# Altium project USBc to Ethernet(2.0).PrjPcb (part 1 of 3)
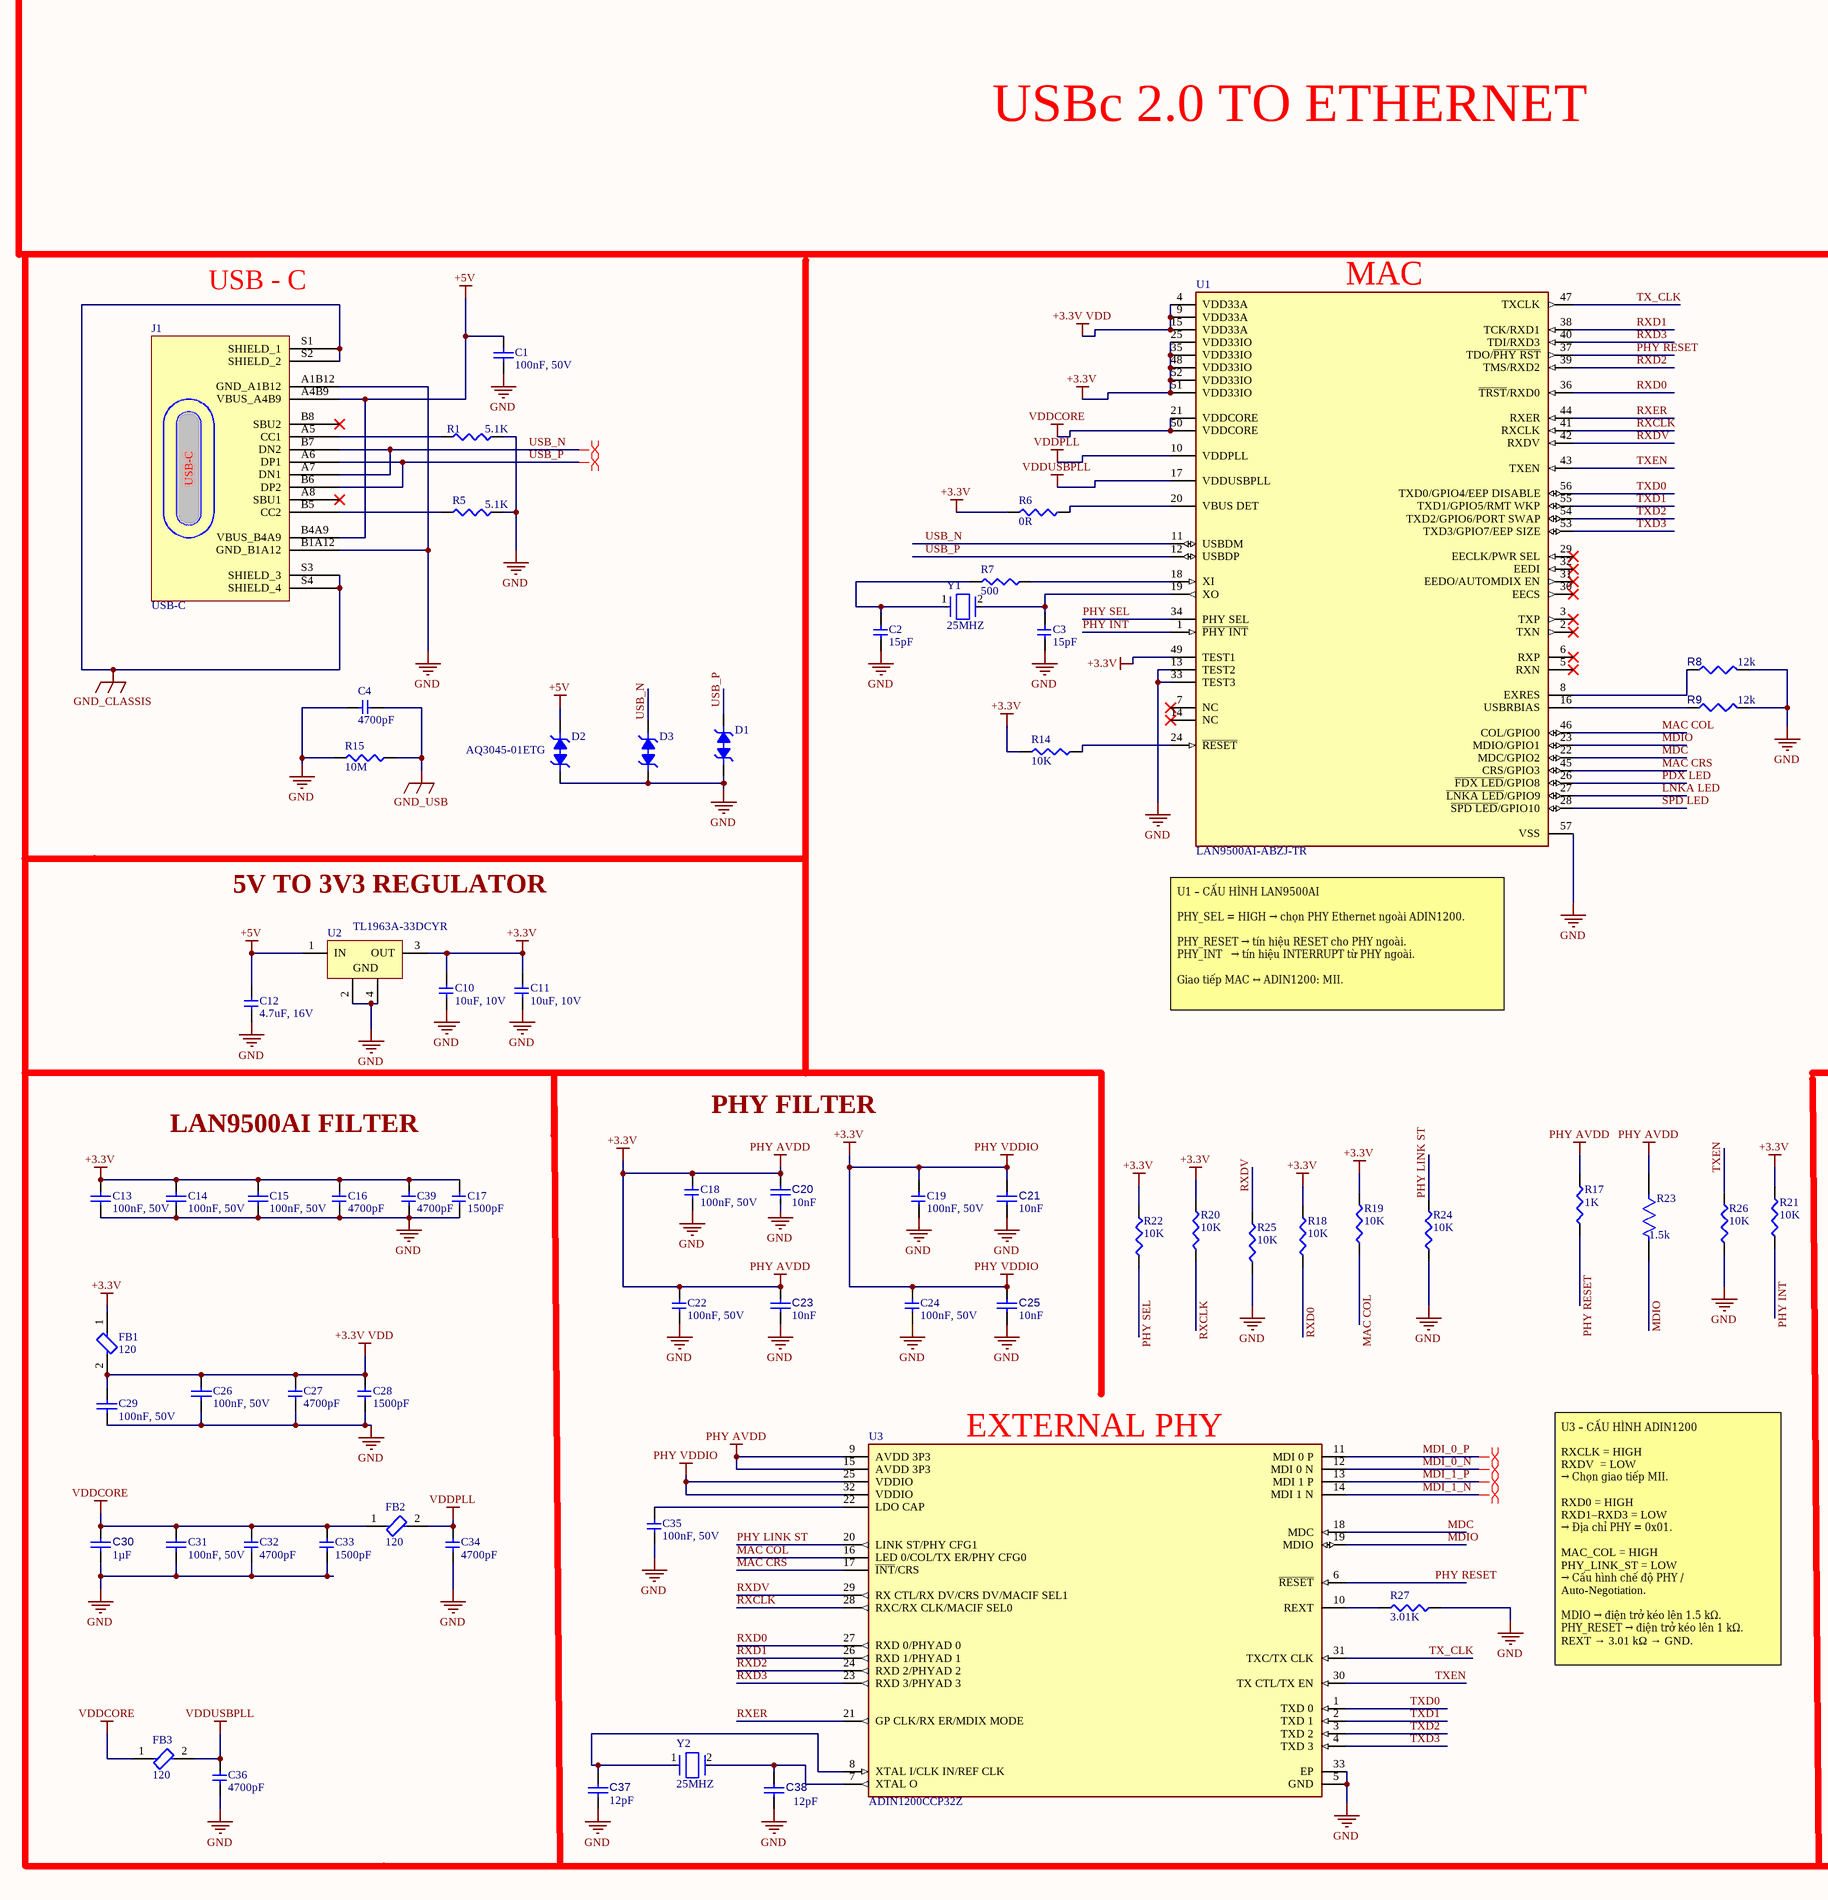
[diagram p0: USBc to Ethernet(2.0).SchDoc, left]
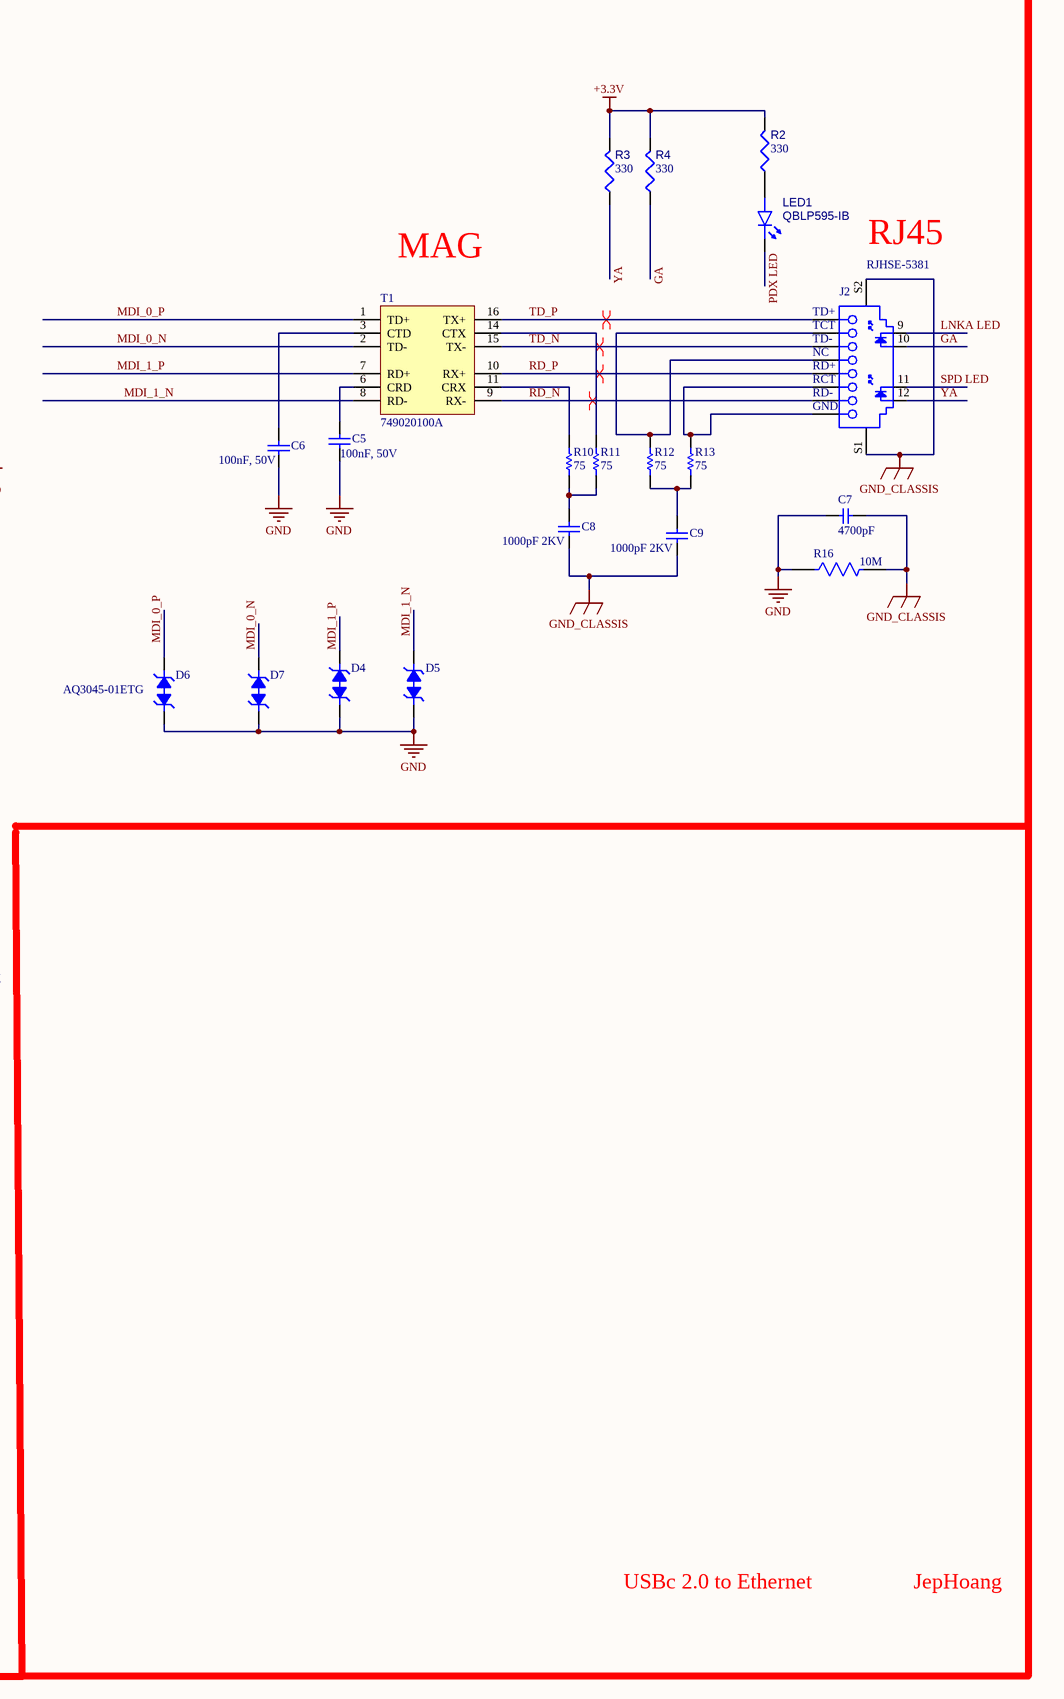
[diagram p1: USBc to Ethernet(2.0).SchDoc, right]
1 sheet, 85 parts. Net scope: global (net labels, ports and power ports of the same name join across sheets).
Board file: USBc to Ethernet(2.0).PcbDoc

## Sheet USBc to Ethernet(2.0).SchDoc
size A2; SheetNumber: 1; SheetTotal: 1

### Parts
C1  100nF, 50V  [CAP_0402]
C2  15pF  [CAP_0402]
C3  15pF  [CAP_0402]
C4  4700pF  [CAP_0402]
C5  100nF, 50V  [CAP_0402]
C6  100nF, 50V  [CAP_0402]
C7  4700pF  [CAP_0402]
C8  1000pF 2KV  [JD-202R18W102KV4E-2_M]
C9  1000pF 2KV  [JD-202R18W102KV4E-2_M]
C10  10uF, 10V  [CAP_0402]
C11  10uF, 10V  [CAP_0402]
C12  4.7uF, 16V  [CAP_0402]
C13  100nF, 50V  [CAP_0402]
C14  100nF, 50V  [CAP_0402]
C15  100nF, 50V  [CAP_0402]
C16  4700pF  [CAP_0402]
C17  1500pF  [CAP_0402]
C18  100nF, 50V  [CAP_0402]
C19  100nF, 50V  [CAP_0402]
C20  value 10nF  [CAPC0402(1005)60_L]  (hidden comment: Capacitor 10nF +/-20% 50V 0402)
C21  value 10nF  [CAPC0402(1005)60_L]  (hidden comment: Capacitor 10nF +/-20% 50V 0402)
C22  100nF, 50V  [CAP_0402]
C23  value 10nF  [CAPC0402(1005)60_L]  (hidden comment: Capacitor 10nF +/-20% 50V 0402)
C24  100nF, 50V  [CAP_0402]
C25  value 10nF  [CAPC0402(1005)60_L]  (hidden comment: Capacitor 10nF +/-20% 50V 0402)
C26  100nF, 50V  [CAP_0402]
C27  4700pF  [CAP_0402]
C28  1500pF  [CAP_0402]
C29  100nF, 50V  [CAP_0402]
C30  value 1µF  [CAPC0402(1005)60_L]  (hidden comment: Capacitor 1µF +/-20% 10V 0402)
C31  100nF, 50V  [CAP_0402]
C32  4700pF  [CAP_0402]
C33  1500pF  [CAP_0402]
C34  4700pF  [CAP_0402]
C35  100nF, 50V  [CAP_0402]
C36  4700pF  [CAP_0402]
C37  value 12pF  [CAPC0402(1005)33_L]  (hidden comment: Capacitor 12pF +/-10% 50V 0402)
C38  value 12pF  [CAPC0402(1005)33_L]  (hidden comment: Capacitor 12pF +/-10% 50V 0402)
C39  4700pF  [CAP_0402]
D1  (no value)  [DIODE_0402]
D2  AQ3045-01ETG  [DIODE_0402]
D3  (no value)  [DIODE_0402]
D4  (no value)  [DIODE_0402]
D5  (no value)  [DIODE_0402]
D6  AQ3045-01ETG  [DIODE_0402]
D7  (no value)  [DIODE_0402]
FB1  120  [RES_0603]
FB2  120  [RES_0603]
FB3  120  [RES_0603]
J1  USB-C  [USBc_16PIN_QFN__footprint]
J2  RJHSE-5381  [AMPH-RJHSE-5381_V]
LED1  QBLP595-IB  [QTB-QBLP595_V]
R1  5.1K  [RES_0402]
R2  value 330  [RESC0402(1005)_L]  (hidden comment: Resistor 330R +/-5 % 0402 63 mW)
R3  value 330  [RESC0402(1005)_L]  (hidden comment: Resistor 330R +/-5 % 0402 63 mW)
R4  value 330  [RESC0402(1005)_L]  (hidden comment: Resistor 330R +/-5 % 0402 63 mW)
R5  5.1K  [RES_0402]
R6  0R  [RES_0402]
R7  500  [RES_0402]
R8  value 12k  [RESC0402(1005)_L]  (hidden comment: 12KR2F)
R9  value 12k  [RESC0402(1005)_L]  (hidden comment: 12KR2F)
R10  75  [RESC1005X40X25LL05T10]
R11  75  [RESC1005X40X25LL05T10]
R12  75  [RESC1005X40X25LL05T10]
R13  75  [RESC1005X40X25LL05T10]
R14  10K  [RES_0402]
R15  10M  [RES_0603]
R16  10M  [FP-CRCW0603-e3-IPC_A]
R17  1K  [RES_0402]
R18  10K  [RES_0402]
R19  10K  [RES_0402]
R20  10K  [RES_0402]
R21  10K  [RES_0402]
R22  10K  [RES_0402]
R23  1.5k  [FP-RT0402-MFG]
R24  10K  [RES_0402]
R25  10K  [RES_0402]
R26  10K  [RES_0402]
R27  3.01K  [RES_0402]
T1  749020100A  [749020100A]
U1  LAN9500AI-ABZJ-TR  [FP-56QFN-5904-8x8B-MFG]
U2  TL1963A-33DCYR  [Regulator_4PIN]
U3  ADIN1200CCP32Z  [FP-CP-32-31-MFG]
Y1  25MHZ  [Crystal_25MHZ]
Y2  25MHZ  [Crystal_25MHZ]

### Nets
+3.3V: C10.2 C11.2 C13.2 C14.2 C15.2 C16.2 C17.2 C18.2 C19.2 C20.2 C21.2 C22.2 C23.2 C24.2 C25.2 C39.2 FB1.1 R2.2 R3.2 R4.2 R6.1 R14.2 R17.2 R18.2 R19.2 R20.2 R21.2 R22.2 R23.1 U1.25(VDD33IO) U1.35(VDD33IO) U1.48(VDD33IO) U1.49(TEST1) U1.51(VDD33IO) U1.52(VDD33IO) U2.3(OUT) U3.9(AVDD_3P3) U3.15(AVDD_3P3) U3.25(VDDIO) U3.32(VDDIO)  [also labelled PHY AVDD, PHY VDDIO]
+3.3V VDD: C26.2 C27.2 C28.2 C29.2 FB1.2 U1.4(VDD33A) U1.9(VDD33A) U1.15(VDD33A)
+5V: C1.2 C12.2 D2.2 J1.A4B9(VBUS_A4B9) J1.B4A9(VBUS_B4A9) U2.1(IN)
GND: C1.1 C2.1 C3.1 C4.1 C5.1 C6.1 C7.2 C10.1 C11.1 C12.1 C13.1 C14.1 C15.1 C16.1 C17.1 C18.1 C19.1 C20.1 C21.1 C22.1 C23.1 C24.1 C25.1 C26.1 C27.1 C28.1 C29.1 C30.1 C31.1 C32.1 C33.1 C34.1 C35.1 C36.1 C37.2 C38.2 C39.1 D1.1 D2.1 D3.1 D4.1 D5.1 D6.1 D7.1 J1.A1B12(GND_A1B12) J1.B1A12(GND_B1A12) R1.2 R5.2 R8.2 R9.2 R15.1 R16.1 R24.1 R25.1 R26.1 R27.2 U1.13(TEST2) U1.33(TEST3) U1.57(VSS) U2.2(GND) U2.4(GND) U3.5(GND) U3.33(EP)
GND_CLASSIS: C7.1 C8.1 C9.1 J1.S1(SHIELD_1) J1.S2(SHIELD_2) J1.S3(SHIELD_3) J1.S4(SHIELD_4) J2.S1 J2.S2 R16.2
GND_USB: C4.2 R15.2
VDDCORE: C30.2 C31.2 C32.2 C33.2 FB2.1 FB3.1 U1.21(VDDCORE) U1.50(VDDCORE)
VDDPLL: C34.2 FB2.2 U1.10(VDDPLL)
VDDUSBPLL: C36.2 FB3.2 U1.17(VDDUSBPLL)
GA: J2.10 R4.1
LNKA LED: J2.9 U1.27(~{LNKA_LED}/GPIO9)
MAC COL: R19.1 U1.46(COL/GPIO0) U3.16(LED_0/COL/TX_ER/PHY_CFG0)
MAC CRS: U1.45(CRS/GPIO3) U3.17(~{INT}/CRS)
MDC: U1.22(MDC/GPIO2) U3.18(MDC)
MDI_0_N: D7.2 T1.2(TD-) U3.12(MDI_0_N)
MDI_0_P: D6.2 T1.1(TD+) U3.11(MDI_0_P)
MDI_1_N: D5.2 T1.8(RD-) U3.14(MDI_1_N)
MDI_1_P: D4.2 T1.7(RD+) U3.13(MDI_1_P)
MDIO: R23.2 U1.23(MDIO/GPIO1) U3.19(MDIO)
PDX LED: LED1.1(K) U1.26(~{FDX_LED}/GPIO8)
PHY INT: R21.1 U1.1(~{PHY_INT})
PHY LINK ST: R24.2 U3.20(LINK_ST/PHY_CFG1)
PHY RESET: R17.1 U1.37(TDO/~{PHY_RST}) U3.6(~{RESET})
PHY SEL: R22.1 U1.34(PHY_SEL)
RD_N: J2.7(RD-) T1.9(RX-)
RD_P: J2.5(RD+) T1.10(RX+)
RXCLK: R20.1 U1.41(RXCLK) U3.28(RXC/RX_CLK/MACIF_SEL0)
RXD0: R18.1 U1.36(~{TRST}/RXD0) U3.27(RXD_0/PHYAD_0)
RXD1: U1.38(TCK/RXD1) U3.26(RXD_1/PHYAD_1)
RXD2: U1.39(TMS/RXD2) U3.24(RXD_2/PHYAD_2)
RXD3: U1.40(TDI/RXD3) U3.23(RXD_3/PHYAD_3)
RXDV: R25.2 U1.42(RXDV) U3.29(RX_CTL/RX_DV/CRS_DV/MACIF_SEL1)
RXER: U1.44(RXER) U3.21(GP_CLK/RX_ER/MDIX_MODE)
SPD LED: J2.11 U1.28(~{SPD_LED}/GPIO10)
TD_N: J2.3(TD-) T1.15(TX-)
TD_P: J2.1(TD+) T1.16(TX+)
TX_CLK: U1.47(TXCLK) U3.31(TXC/TX_CLK)
TXD0: U1.56(TXD0/GPIO4/EEP_DISABLE) U3.1(TXD_0)
TXD1: U1.55(TXD1/GPIO5/RMT_WKP) U3.2(TXD_1)
TXD2: U1.54(TXD2/GPIO6/PORT_SWAP) U3.3(TXD_2)
TXD3: U1.53(TXD3/GPIO7/EEP_SIZE) U3.4(TXD_3)
TXEN: R26.2 U1.43(TXEN) U3.30(TX_CTL/TX_EN)
USB_N: D3.2 J1.A7(DN1) J1.B7(DN2) U1.11(USBDM)
USB_P: D1.2 J1.A6(DP1) J1.B6(DP2) U1.12(USBDP)
YA: J2.12 R3.1
NetC2_2: C2.2 R7.1 Y1.1
NetC3_2: C3.2 U1.19(XO) Y1.2
NetC5_2: C5.2 T1.6(CRD)
NetC6_2: C6.2 T1.3(CTD)
NetC8_2: C8.2 R10.1 R11.1
NetC9_2: C9.2 R12.1 R13.1
NetC35_2: C35.2 U3.22(LDO_CAP)
NetC37_1: C37.1 U3.8(XTAL_I/CLK_IN/REF_CLK) Y2.1
NetC38_1: C38.1 U3.7(XTAL_O) Y2.2
NetJ1_A5: J1.A5(CC1) R1.1
NetJ1_B5: J1.B5(CC2) R5.1
NetJ2_2: J2.2(TCT) J2.4(NC) R12.2
NetJ2_6: J2.6(RCT) J2.8(GND) R13.2
NetLED1_2: LED1.2(A) R2.1
NetR6_2: R6.2 U1.20(VBUS_DET)
NetR7_2: R7.2 U1.18(XI)
NetR8_1: R8.1 U1.8(EXRES)
NetR9_1: R9.1 U1.16(USBRBIAS)
NetR10_2: R10.2 T1.11(CRX)
NetR11_2: R11.2 T1.14(CTX)
NetR14_1: R14.1 U1.24(~{RESET})
NetR27_1: R27.1 U3.10(REXT)

Not connected (* = marked no-connect by the designer): J1 A8(SBU1)* B8(SBU2)*; U1 2(TXN)* 3(TXP)* 5(RXN)* 6(RXP)* 7(NC)* 14(NC)* 29(EECLK/PWR_SEL)* 30(EECS)* 31(EEDO/AUTOMDIX_EN)* 32(EEDI)*

### Layout directives
differential pair; differential pair class DIFF90: USB_N, USB_P
differential pair; differential pair class DIFF100: MDI_0_N, MDI_0_P, MDI_1_N, MDI_1_P, RD_N, RD_P, TD_N, TD_P

### Notes on the sheet
- USBc 2.0 TO ETHERNET
- USB - C
- (near U1) MAC
- MAG
- RJ45
- 5V TO 3V3 REGULATOR
- (near U1) U1 – CẤU HÌNH LAN9500AI
  PHY_SEL = HIGH → chọn PHY Ethernet ngoài ADIN1200.
  PHY_RESET → tín hiệu RESET cho PHY ngoài.
  PHY_INT   → tín hiệu INTERRUPT từ PHY ngoài.
  Giao tiếp MAC ↔ ADIN1200: MII.
- PHY FILTER
- LAN9500AI FILTER
- (near U3) EXTERNAL PHY
- U3 – CẤU HÌNH ADIN1200
  RXCLK = HIGH
  RXDV  = LOW
  → Chọn giao tiếp MII.
  RXD0 = HIGH
  RXD1–RXD3 = LOW
  → Địa chỉ PHY = 0x01.
  MAC_COL = HIGH
  PHY_LINK_ST = LOW
  → Cấu hình chế độ PHY / Auto-Negotiation.
  MDIO → điện trở kéo lên 1.5 kΩ.
  PHY_RESET → điện trở kéo lên 1 kΩ.
  REXT → 3.01 kΩ → GND.
- USBc 2.0 to Ethernet
- JepHoang